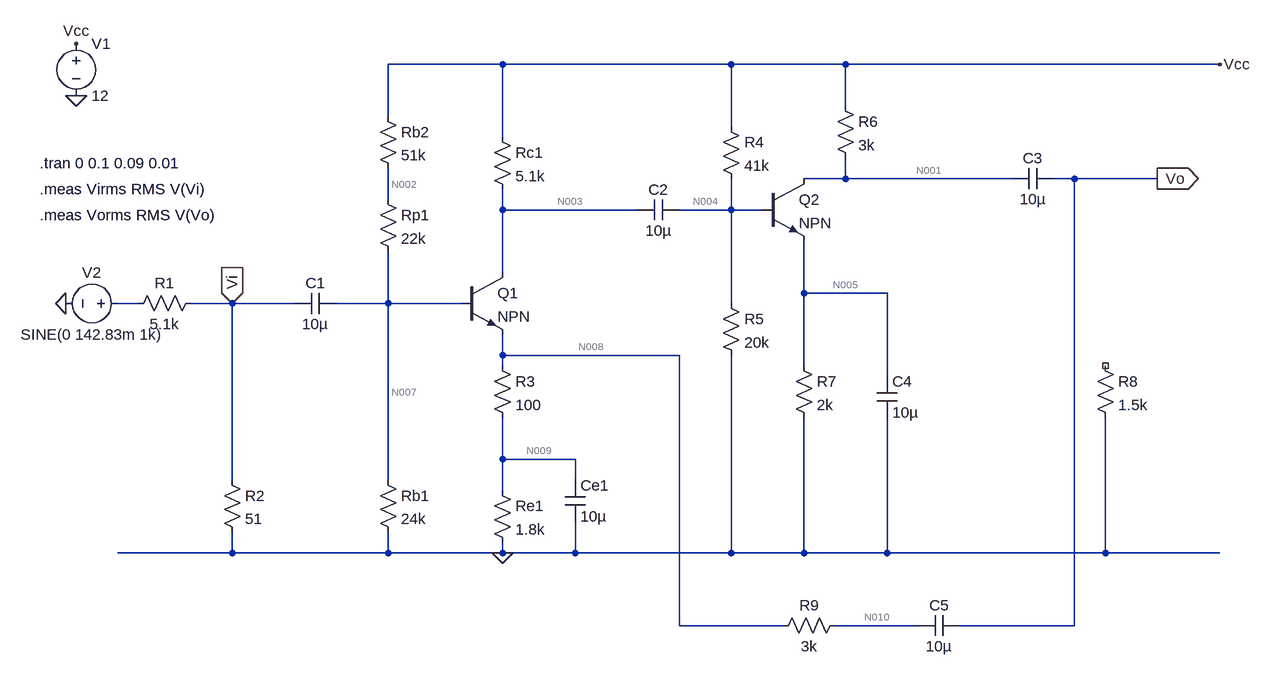
[diagram p0: schematic Experiment3_1_1.asc]
Experiment3_1_1.asc, the LTspice schematic file:
Version 4.1
SHEET 1 1464 880
WIRE 288 -32 112 -32
WIRE 640 -32 288 -32
WIRE 816 -32 640 -32
WIRE 1392 -32 816 -32
WIRE 816 32 816 -32
WIRE 112 48 112 -32
WIRE 640 64 640 -32
WIRE 288 80 288 -32
WIRE 816 144 816 112
WIRE 816 144 752 144
WIRE 1072 144 816 144
WIRE 1168 144 1136 144
WIRE 1296 144 1168 144
WIRE 112 176 112 128
WIRE 288 192 288 160
WIRE 496 192 288 192
WIRE 640 192 640 144
WIRE 640 192 560 192
WIRE 688 192 640 192
WIRE 288 288 288 192
WIRE 752 320 752 240
WIRE 880 320 752 320
WIRE -272 336 -304 336
WIRE -128 336 -192 336
WIRE -32 336 -128 336
WIRE 112 336 112 256
WIRE 112 336 32 336
WIRE 224 336 112 336
WIRE 640 336 640 192
WIRE 288 416 288 384
WIRE 560 416 288 416
WIRE 288 432 288 416
WIRE 752 432 752 320
WIRE 880 448 880 320
WIRE 288 576 288 512
WIRE 400 576 288 576
WIRE -128 608 -128 336
WIRE 112 608 112 336
WIRE 400 608 400 576
WIRE 288 624 288 576
WIRE -128 720 -128 688
WIRE -128 720 -304 720
WIRE 112 720 112 688
WIRE 112 720 -128 720
WIRE 288 720 288 704
WIRE 288 720 112 720
WIRE 400 720 400 672
WIRE 400 720 288 720
WIRE 640 720 640 416
WIRE 640 720 400 720
WIRE 752 720 752 512
WIRE 752 720 640 720
WIRE 880 720 880 512
WIRE 880 720 752 720
WIRE 1216 720 1216 512
WIRE 1216 720 880 720
WIRE 1392 720 1216 720
WIRE 560 832 560 416
WIRE 720 832 560 832
WIRE 928 832 800 832
WIRE 1168 832 1168 144
WIRE 1168 832 992 832
FLAG 288 720 0
FLAG 1392 -32 Vcc
FLAG -368 -64 Vcc
FLAG -368 16 0
FLAG -384 336 0
FLAG 1296 144 Vo
IOPIN 1296 144 Out
FLAG -128 336 Vi
IOPIN -128 336 In
SYMBOL res -176 320 R90
WINDOW 0 0 56 VBottom 2
WINDOW 3 32 56 VTop 2
SYMATTR InstName R1
SYMATTR Value 5.1k
SYMBOL res -144 592 R0
SYMATTR InstName R2
SYMATTR Value 51
SYMBOL res 96 592 R0
SYMATTR InstName Rb1
SYMATTR Value 24k
SYMBOL res 96 160 R0
SYMATTR InstName Rp1
SYMATTR Value 22k
SYMBOL res 96 32 R0
SYMATTR InstName Rb2
SYMATTR Value 51k
SYMBOL npn 224 288 R0
SYMATTR InstName Q1
SYMBOL res 272 608 R0
SYMATTR InstName Re1
SYMATTR Value 1.8k
SYMBOL res 272 64 R0
SYMATTR InstName Rc1
SYMATTR Value 5.1k
SYMBOL voltage -368 -80 R0
WINDOW 123 0 0 Left 0
WINDOW 39 0 0 Left 0
SYMATTR InstName V1
SYMATTR Value 12
SYMBOL cap 32 320 R90
WINDOW 0 0 32 VBottom 2
WINDOW 3 32 32 VTop 2
SYMATTR InstName C1
SYMATTR Value 10µ
SYMATTR SpiceLine V=6.3 Irms=0 Rser=4 Lser=0 mfg="AVX" pn="TAJA106M006" type="Tantalum"
SYMBOL cap 496 208 R270
WINDOW 0 32 32 VTop 2
WINDOW 3 0 32 VBottom 2
SYMATTR InstName C2
SYMATTR Value 10µ
SYMATTR SpiceLine V=6.3 Irms=0 Rser=4 Lser=0 mfg="AVX" pn="TAJA106M006" type="Tantalum"
SYMBOL cap 384 608 R0
SYMATTR Value 10µ
SYMATTR InstName Ce1
SYMATTR SpiceLine V=6.3 Irms=0 Rser=4 Lser=0 mfg="AVX" pn="TAJA106M006" type="Tantalum"
SYMBOL voltage -288 336 R90
WINDOW 0 -32 56 VBottom 2
WINDOW 3 32 56 VTop 2
WINDOW 123 0 0 Left 0
WINDOW 39 0 0 Left 0
SYMATTR InstName V2
SYMATTR Value SINE(0 142.83m 1k)
SYMBOL res 272 416 R0
SYMATTR InstName R3
SYMATTR Value 100
SYMBOL res 624 48 R0
SYMATTR InstName R4
SYMATTR Value 41k
SYMBOL res 624 320 R0
SYMATTR InstName R5
SYMATTR Value 20k
SYMBOL npn 688 144 R0
SYMATTR InstName Q2
SYMBOL res 800 16 R0
SYMATTR InstName R6
SYMATTR Value 3k
SYMBOL cap 1072 160 R270
WINDOW 0 32 32 VTop 2
WINDOW 3 0 32 VBottom 2
SYMATTR InstName C3
SYMATTR Value 10µ
SYMATTR SpiceLine V=6.3 Irms=0 Rser=4 Lser=0 mfg="AVX" pn="TAJA106M006" type="Tantalum"
SYMBOL res 736 416 R0
SYMATTR InstName R7
SYMATTR Value 2k
SYMBOL cap 864 448 R0
SYMATTR InstName C4
SYMATTR Value 10µ
SYMATTR SpiceLine V=6.3 Irms=0 Rser=4 Lser=0 mfg="AVX" pn="TAJA106M006" type="Tantalum"
SYMBOL res 1200 416 R0
SYMATTR InstName R8
SYMATTR Value 1.5k
SYMBOL res 816 816 R90
WINDOW 0 0 56 VBottom 2
WINDOW 3 32 56 VTop 2
SYMATTR InstName R9
SYMATTR Value 3k
SYMBOL cap 928 848 R270
WINDOW 0 32 32 VTop 2
WINDOW 3 0 32 VBottom 2
SYMATTR InstName C5
SYMATTR Value 10µ
SYMATTR SpiceLine V=6.3 Irms=0 Rser=4 Lser=0 mfg="AVX" pn="TAJA106M006" type="Tantalum"
TEXT -424 120 Left 2 !.tran 0 0.1 0.09 0.01
TEXT -424 160 Left 2 !.meas Virms RMS V(Vi)
TEXT -424 200 Left 2 !.meas Vorms RMS V(Vo)

The netlist it stands for:
* Experiment3_1_1.asc
R1 Vi N006 5.1k
R2 Vi 0 51
Rb1 N007 0 24k
Rp1 N002 N007 22k
Rb2 Vcc N002 51k
Q1 N003 N007 N008 0 NPN
Re1 N009 0 1.8k
Rc1 Vcc N003 5.1k
V1 Vcc 0 12
C1 N007 Vi 10µ V=6.3 Irms=0 Rser=4 Lser=0 mfg="AVX" pn="TAJA106M006" type="Tantalum"
C2 N003 N004 10µ V=6.3 Irms=0 Rser=4 Lser=0 mfg="AVX" pn="TAJA106M006" type="Tantalum"
Ce1 N009 0 10µ V=6.3 Irms=0 Rser=4 Lser=0 mfg="AVX" pn="TAJA106M006" type="Tantalum"
V2 N006 0 SINE(0 142.83m 1k)
R3 N008 N009 100
R4 Vcc N004 41k
R5 N004 0 20k
Q2 N001 N004 N005 0 NPN
R6 Vcc N001 3k
C3 N001 Vo 10µ V=6.3 Irms=0 Rser=4 Lser=0 mfg="AVX" pn="TAJA106M006" type="Tantalum"
R7 N005 0 2k
C4 N005 0 10µ V=6.3 Irms=0 Rser=4 Lser=0 mfg="AVX" pn="TAJA106M006" type="Tantalum"
R8 NC_01 0 1.5k
R9 N010 N008 3k
C5 N010 Vo 10µ V=6.3 Irms=0 Rser=4 Lser=0 mfg="AVX" pn="TAJA106M006" type="Tantalum"
.model NPN NPN
.model PNP PNP
.lib standard.bjt
.tran 0 0.1 0.09 0.01
.meas Virms RMS V(Vi)
.meas Vorms RMS V(Vo)
.backanno
.end

* Results of the author's LTspice run, read from the files saved beside the schematic
* Operating Point, zero values left out:
*   V(n002) = 5.559 V
*   V(vcc) = 12 V
*   V(n008) = 2.005 V
*   V(n001) = 7.613 V
*   V(vo) = 96.18 µV
*   V(n007) = 2.78 V
*   V(n003) = 6.671 V
*   V(n009) = 1.899 V
*   V(n004) = 3.738 V
*   V(n005) = 2.954 V
*   V(n010) = 2.005 V
*   Ic(Q1) = 1.045 mA
*   Ib(Q1) = 10.45 µA
*   Ie(Q1) = -1.055 mA
*   I(R3) = 1.055 mA
*   I(R5) = 186.9 µA
*   I(Rb1) = 115.8 µA
*   I(Rb2) = 126.3 µA
*   I(Rc1) = 1.045 mA
*   I(Rp1) = 126.3 µA
*   I(Re1) = 1.055 mA
*   I(V1) = -2.835 mA
*   I(R4) = 201.5 µA
*   Ic(Q2) = 1.462 mA
*   Ib(Q2) = 14.62 µA
*   Ie(Q2) = -1.477 mA
*   I(R6) = 1.462 mA
*   I(R7) = 1.477 mA
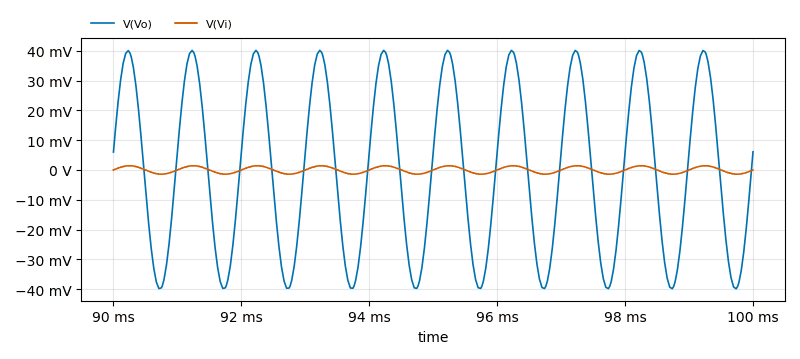
[diagram p1: Transient Analysis of Experiment3_1_1.asc, plotted from the saved traces]
* Transient Analysis, 1 run:
*   V(Vo): min -39.86 mV, max 40.11 mV, average 83.99 µV, rms 28.32 mV, last 6.092 mV
*   V(Vi): min -1.41 mV, max 1.41 mV, average 33.6 nV, rms 997.7 µV, last 23.68 nV
* From the log:
*   virms: RMS(V(Vi))=0.000992548623452 FROM 0 TO 0.01
*   vorms: RMS(V(Vo))=0.0281720886668 FROM 0 TO 0.01